# Altium schematic sheet UC-520.SchDoc
size A3
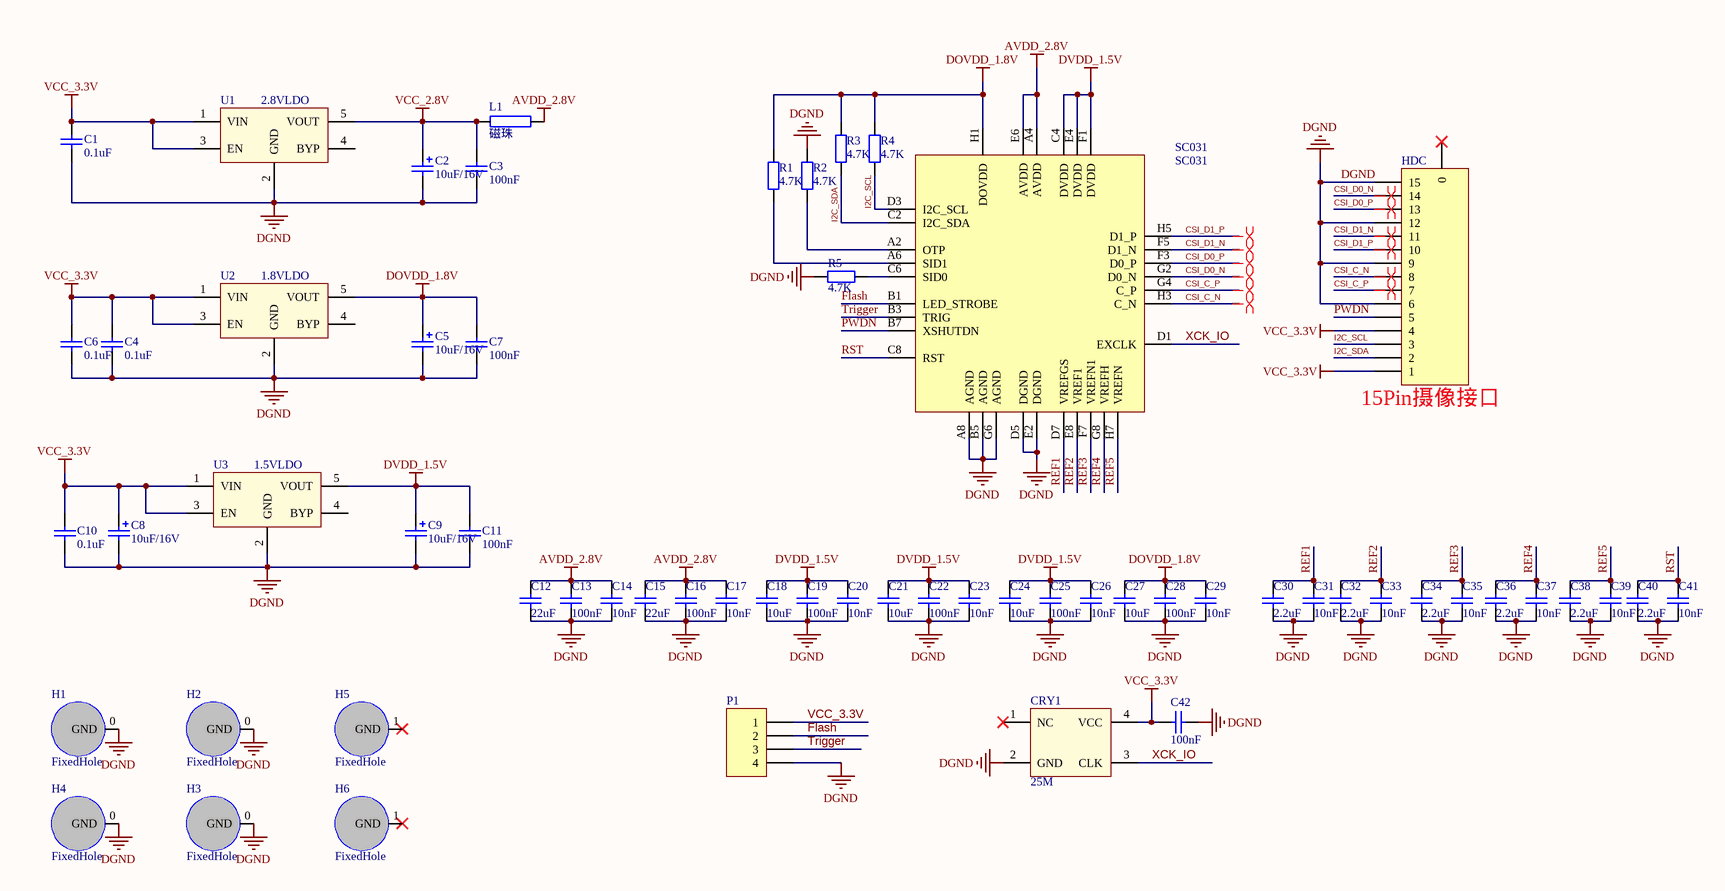
[diagram p0: UC-520.SchDoc]

## Parts
C1  0.1uF  [C0603]
C2  10uF/16V  [钽电容（A型）]
C3  100nF  [C0603]
C4  0.1uF  [C0603]
C5  10uF/16V  [钽电容（A型）]
C6  0.1uF  [C0603]
C7  100nF  [C0603]
C8  10uF/16V  [钽电容（A型）]
C9  10uF/16V  [钽电容（A型）]
C10  0.1uF  [C0603]
C11  100nF  [C0603]
C12  22uF  [C0603]
C13  100nF  [C0603]
C14  10nF  [C0603]
C15  22uF  [C0603]
C16  100nF  [C0603]
C17  10nF  [C0603]
C18  10uF  [C0603]
C19  100nF  [C0603]
C20  10nF  [C0603]
C21  10uF  [C0603]
C22  100nF  [C0603]
C23  10nF  [C0603]
C24  10uF  [C0603]
C25  100nF  [C0603]
C26  10nF  [C0603]
C27  10uF  [C0603]
C28  100nF  [C0603]
C29  10nF  [C0603]
C30  2.2uF  [C0603]
C31  10nF  [C0603]
C32  2.2uF  [C0603]
C33  10nF  [C0603]
C34  2.2uF  [C0603]
C35  10nF  [C0603]
C36  2.2uF  [C0603]
C37  10nF  [C0603]
C38  2.2uF  [C0603]
C39  10nF  [C0603]
C40  2.2uF  [C0603]
C41  10nF  [C0603]
C42  100nF  [C0603]
CRY1  25M  [爱普生晶振3.2×2.5MM]
H1  FixedHole  [HOLE_M2]
H2  FixedHole  [HOLE_M2]
H3  FixedHole  [HOLE_M2]
H4  FixedHole  [HOLE_M2]
H5  FixedHole  [HOLE_M2]
H6  FixedHole  [HOLE_M2]
HDC  Header 15  [OV5647_MIPI]  (value not drawn)
L1  磁珠  [L0603]
P1  Header 4  [HDR1X4]  (value not drawn)
R1  4.7K  [R0603]
R2  4.7K  [R0603]
R3  4.7K  [R0603]
R4  4.7K  [R0603]
R5  4.7K  [R0603]
SC031  SC031  [BGA32]
U1  2.8VLDO  [SOT23-5]
U2  1.8VLDO  [SOT23-5]
U3  1.5VLDO  [SOT23-5]

## Nets
AVDD_2.8V: C12.2 C13.2 C14.2 C15.2 C16.2 C17.2 L1.1 SC031.A4(AVDD) SC031.E6(AVDD)
DGND: C1.2 C2.2 C3.2 C4.2 C5.2 C6.2 C7.2 C8.2 C9.2 C10.2 C11.2 C12.1 C13.1 C14.1 C15.1 C16.1 C17.1 C18.1 C19.1 C20.1 C21.1 C22.1 C23.1 C24.1 C25.1 C26.1 C27.1 C28.1 C29.1 C30.1 C31.1 C32.1 C33.1 C34.1 C35.1 C36.1 C37.1 C38.1 C39.1 C40.1 C41.1 C42.1 CRY1.2(GND) H1.0(GND) H2.0(GND) H3.0(GND) H4.0(GND) HDC.6 HDC.9 HDC.12 HDC.15 P1.4 R2.2 R5.2 SC031.A8(AGND) SC031.B5(AGND) SC031.D5(DGND) SC031.E2(DGND) SC031.G6(AGND) U1.2(GND) U2.2(GND) U3.2(GND)
DOVDD_1.8V: C5.1 C7.1 C27.2 C28.2 C29.2 R1.1 R3.2 R4.2 SC031.H1(DOVDD) U2.5(VOUT)
DVDD_1.5V: C9.1 C11.1 C18.2 C19.2 C20.2 C21.2 C22.2 C23.2 C24.2 C25.2 C26.2 SC031.C4(DVDD) SC031.E4(DVDD) SC031.F1(DVDD) U3.5(VOUT)
VCC_2.8V: C2.1 C3.1 L1.2 U1.5(VOUT)
VCC_3.3V: C1.1 C4.1 C6.1 C8.1 C10.1 C42.2 CRY1.4(VCC) HDC.1 HDC.4 P1.1 U1.1(VIN) U1.3(EN) U2.1(VIN) U2.3(EN) U3.1(VIN) U3.3(EN)
CSI_C_N: HDC.8 SC031.H3(C_N)
CSI_C_P: HDC.7 SC031.G4(C_P)
CSI_D0_N: HDC.14 SC031.G2(D0_N)
CSI_D0_P: HDC.13 SC031.F3(D0_P)
CSI_D1_N: HDC.11 SC031.F5(D1_N)
CSI_D1_P: HDC.10 SC031.H5(D1_P)
Flash: P1.2 SC031.B1(LED_STROBE)
I2C_SCL: HDC.3 R4.1 SC031.D3(I2C_SCL)
I2C_SDA: HDC.2 R3.1 SC031.C2(I2C_SDA)
PWDN: HDC.5 SC031.B7(XSHUTDN)
REF1: C30.2 C31.2 SC031.D7(VREFGS)
REF2: C32.2 C33.2 SC031.E8(VREF1)
REF3: C34.2 C35.2 SC031.F7(VREFN1)
REF4: C36.2 C37.2 SC031.G8(VREFH)
REF5: C38.2 C39.2 SC031.H7(VREFN)
RST: C40.2 C41.2 SC031.C8(RST)
Trigger: P1.3 SC031.B3(TRIG)
XCK_IO: CRY1.3(CLK) SC031.D1(EXCLK)
NetR1_2: R1.2 SC031.A6(SID1)
NetR2_1: R2.1 SC031.A2(OTP)
NetR5_1: R5.1 SC031.C6(SID0)

Not connected (* = marked no-connect by the designer): CRY1 1(NC)*; H5 1(GND)*; H6 1(GND)*; HDC 0*; U1 4(BYP); U2 4(BYP); U3 4(BYP)

## Layout directives
differential pair: CSI_C_N, CSI_C_P, CSI_D0_N, CSI_D0_P, CSI_D1_N, CSI_D1_P

## Notes on the sheet
- (near HDC) 15Pin摄像接口

## Library data of the parts
C1 C3 C4 C6 C7 C10-C42 = Cap: Capacitor; Value: 100pF; Published: 8-Jun-2000; LatestRevisionDate: 17-Jul-2002; LatestRevisionNote: Re-released for DXP Platform.; PackageReference: RAD-0.3; Publisher: Altium Limited
C2 C5 C8 C9 = Cap Pol2: Polarized Capacitor (Axial); Value: 0.1uF; Published: 8-Jun-2000; LatestRevisionDate: 17-Jul-2002; LatestRevisionNote: Re-released for DXP Platform.; PackageReference: POLAR0.8; Publisher: Altium Limited
CRY1 = 24M
H1-H6 = 固定孔
HDC = Header 15: Header, 15-Pin; LatestRevisionDate: 17-Jul-2002; LatestRevisionNote: Re-released for DXP Platform.; Publisher: Altium Limited
L1 = RES
P1 = Header 4: Header, 4-Pin; LatestRevisionDate: 17-Jul-2002; LatestRevisionNote: Re-released for DXP Platform.; Publisher: Altium Limited
R1-R5 = Res2: Resistor; Value: 1K; Published: 8-Jun-2000; LatestRevisionDate: 17-Jul-2002; LatestRevisionNote: Re-released for DXP Platform.; PackageReference: AXIAL-0.4; Publisher: Altium Limited
U2 U3 = 2.8VLDO